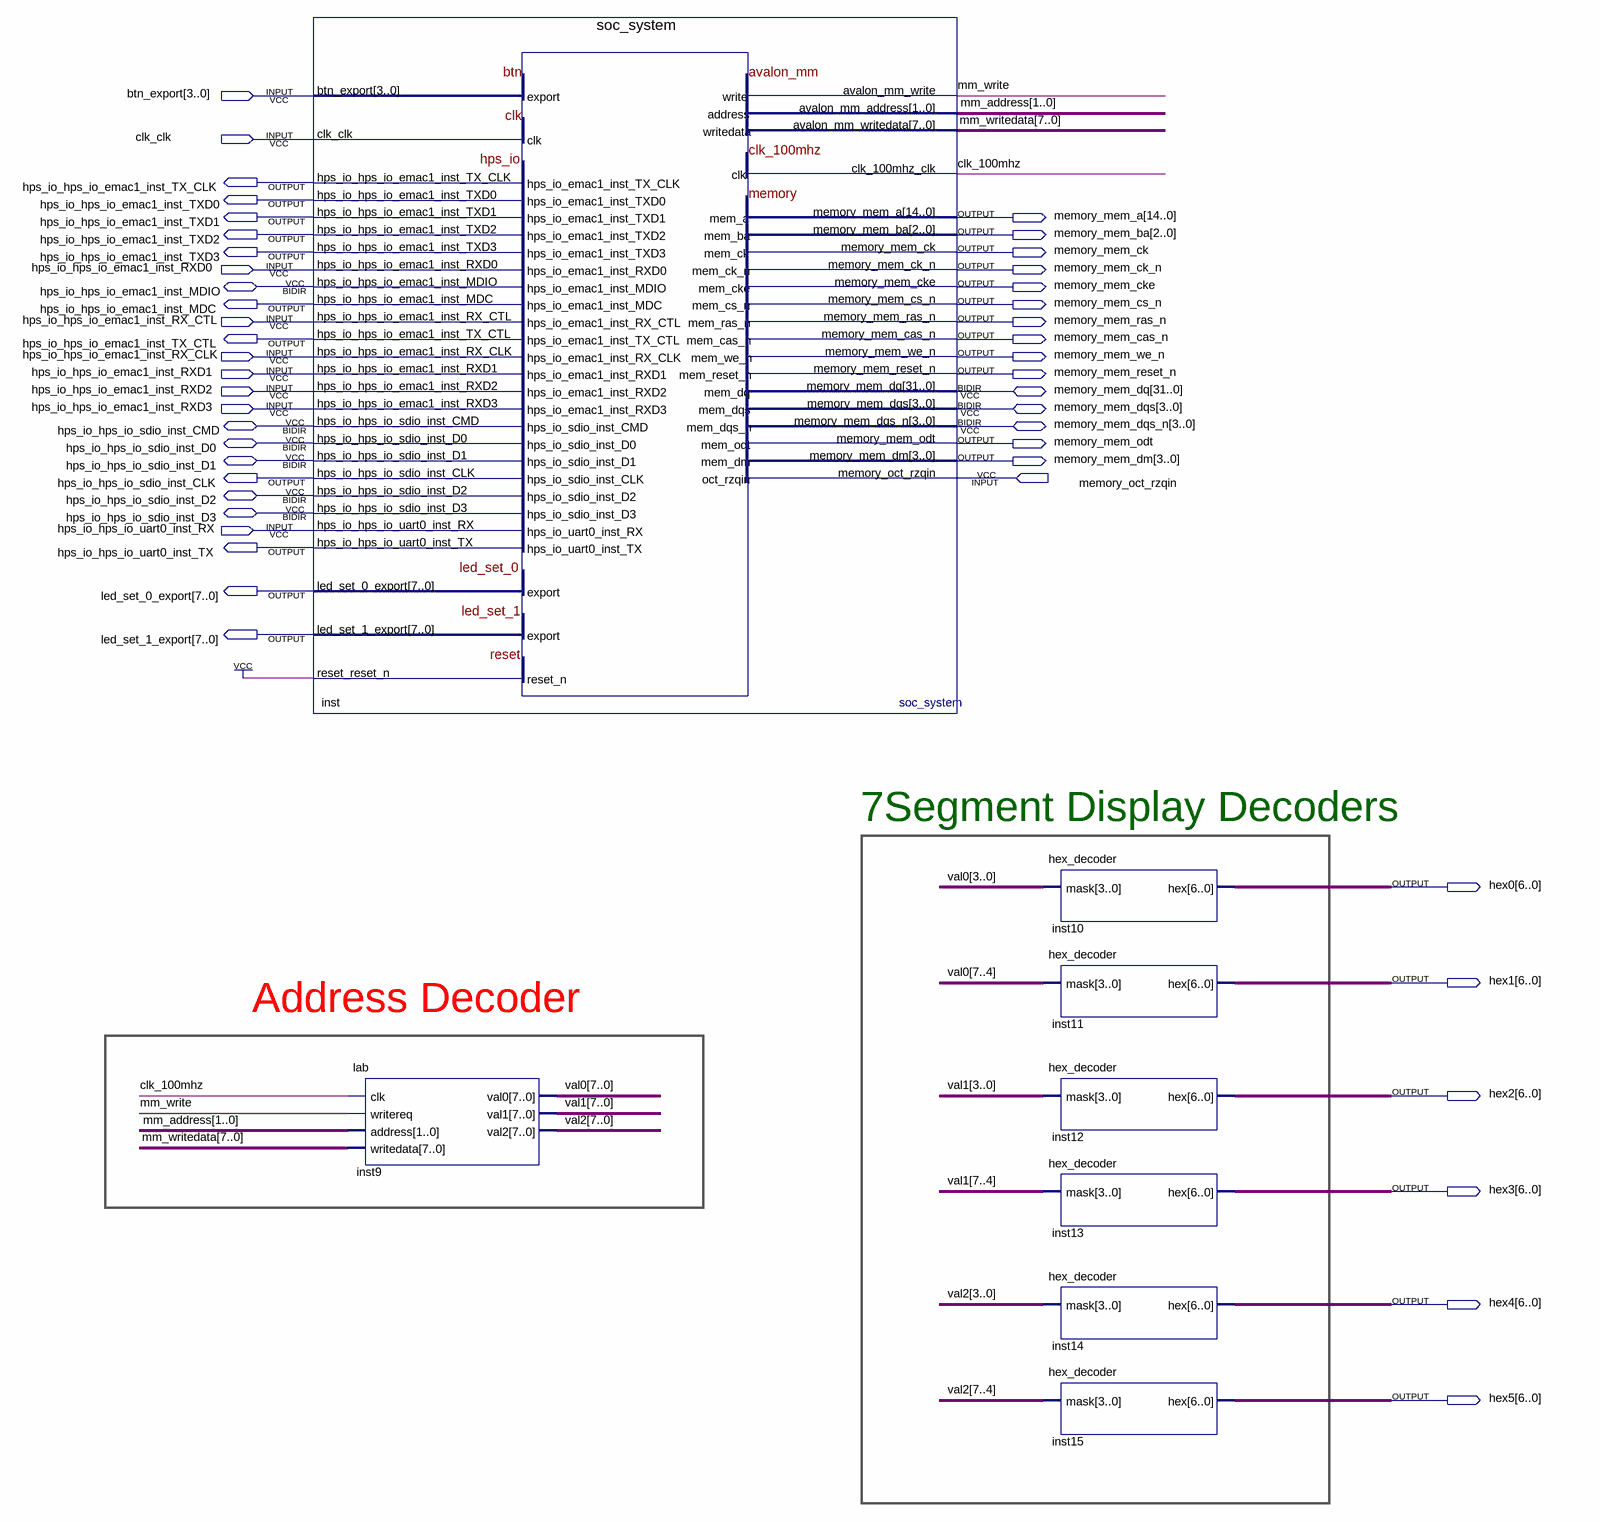
[diagram p0: schematic sheet]
// Quartus schematic main.bdf as structural Verilog: 8 symbols, 48 pins
module main (
  input  [3:0] btn_export,
  input  clk_clk,
  input  hps_io_hps_io_emac1_inst_RXD0,
  input  hps_io_hps_io_emac1_inst_RX_CTL,
  input  hps_io_hps_io_emac1_inst_RX_CLK,
  input  hps_io_hps_io_emac1_inst_RXD1,
  input  hps_io_hps_io_emac1_inst_RXD2,
  input  hps_io_hps_io_emac1_inst_RXD3,
  input  memory_oct_rzqin,
  input  hps_io_hps_io_uart0_inst_RX,
  inout  hps_io_hps_io_emac1_inst_MDIO,
  inout  [31:0] memory_mem_dq,
  inout  [3:0] memory_mem_dqs,
  inout  hps_io_hps_io_sdio_inst_CMD,
  inout  [3:0] memory_mem_dqs_n,
  inout  hps_io_hps_io_sdio_inst_D0,
  inout  hps_io_hps_io_sdio_inst_D1,
  inout  hps_io_hps_io_sdio_inst_D2,
  inout  hps_io_hps_io_sdio_inst_D3,
  output hps_io_hps_io_emac1_inst_TX_CLK,
  output hps_io_hps_io_emac1_inst_TXD0,
  output hps_io_hps_io_emac1_inst_TXD1,
  output [14:0] memory_mem_a,
  output hps_io_hps_io_emac1_inst_TXD2,
  output [2:0] memory_mem_ba,
  output hps_io_hps_io_emac1_inst_TXD3,
  output memory_mem_ck,
  output memory_mem_ck_n,
  output memory_mem_cke,
  output hps_io_hps_io_emac1_inst_MDC,
  output memory_mem_cs_n,
  output memory_mem_ras_n,
  output hps_io_hps_io_emac1_inst_TX_CTL,
  output memory_mem_cas_n,
  output memory_mem_we_n,
  output memory_mem_reset_n,
  output memory_mem_odt,
  output [3:0] memory_mem_dm,
  output hps_io_hps_io_sdio_inst_CLK,
  output hps_io_hps_io_uart0_inst_TX,
  output [7:0] led_set_0_export,
  output [7:0] led_set_1_export,
  output [6:0] hex0,
  output [6:0] hex1,
  output [6:0] hex2,
  output [6:0] hex3,
  output [6:0] hex4,
  output [6:0] hex5
);

  wire clk_100mhz, mm_write;
  wire [1:0] mm_address;
  wire [7:0] mm_writedata, val0, val1, val2;

  soc_system inst (
    .btn_export(btn_export), .clk_clk(clk_clk),
    .hps_io_hps_io_emac1_inst_RXD0(hps_io_hps_io_emac1_inst_RXD0),
    .hps_io_hps_io_emac1_inst_RX_CTL(hps_io_hps_io_emac1_inst_RX_CTL),
    .hps_io_hps_io_emac1_inst_RX_CLK(hps_io_hps_io_emac1_inst_RX_CLK),
    .hps_io_hps_io_emac1_inst_RXD1(hps_io_hps_io_emac1_inst_RXD1),
    .hps_io_hps_io_emac1_inst_RXD2(hps_io_hps_io_emac1_inst_RXD2),
    .hps_io_hps_io_emac1_inst_RXD3(hps_io_hps_io_emac1_inst_RXD3),
    .hps_io_hps_io_uart0_inst_RX(hps_io_hps_io_uart0_inst_RX), .memory_oct_rzqin(memory_oct_rzqin),
    .reset_reset_n(1'b1), .avalon_mm_write(mm_write), .avalon_mm_address(mm_address),
    .avalon_mm_writedata(mm_writedata), .clk_100mhz_clk(clk_100mhz),
    .hps_io_hps_io_emac1_inst_TX_CLK(hps_io_hps_io_emac1_inst_TX_CLK),
    .hps_io_hps_io_emac1_inst_TXD0(hps_io_hps_io_emac1_inst_TXD0),
    .hps_io_hps_io_emac1_inst_TXD1(hps_io_hps_io_emac1_inst_TXD1),
    .hps_io_hps_io_emac1_inst_TXD2(hps_io_hps_io_emac1_inst_TXD2),
    .hps_io_hps_io_emac1_inst_TXD3(hps_io_hps_io_emac1_inst_TXD3),
    .hps_io_hps_io_emac1_inst_MDC(hps_io_hps_io_emac1_inst_MDC),
    .hps_io_hps_io_emac1_inst_TX_CTL(hps_io_hps_io_emac1_inst_TX_CTL),
    .hps_io_hps_io_sdio_inst_CLK(hps_io_hps_io_sdio_inst_CLK),
    .hps_io_hps_io_uart0_inst_TX(hps_io_hps_io_uart0_inst_TX), .led_set_0_export(led_set_0_export),
    .led_set_1_export(led_set_1_export), .memory_mem_a(memory_mem_a), .memory_mem_ba(memory_mem_ba),
    .memory_mem_ck(memory_mem_ck), .memory_mem_ck_n(memory_mem_ck_n), .memory_mem_cke(memory_mem_cke),
    .memory_mem_cs_n(memory_mem_cs_n), .memory_mem_ras_n(memory_mem_ras_n),
    .memory_mem_cas_n(memory_mem_cas_n), .memory_mem_we_n(memory_mem_we_n),
    .memory_mem_reset_n(memory_mem_reset_n), .memory_mem_odt(memory_mem_odt), .memory_mem_dm(memory_mem_dm),
    .hps_io_hps_io_emac1_inst_MDIO(hps_io_hps_io_emac1_inst_MDIO),
    .hps_io_hps_io_sdio_inst_CMD(hps_io_hps_io_sdio_inst_CMD),
    .hps_io_hps_io_sdio_inst_D0(hps_io_hps_io_sdio_inst_D0),
    .hps_io_hps_io_sdio_inst_D1(hps_io_hps_io_sdio_inst_D1),
    .hps_io_hps_io_sdio_inst_D2(hps_io_hps_io_sdio_inst_D2),
    .hps_io_hps_io_sdio_inst_D3(hps_io_hps_io_sdio_inst_D3), .memory_mem_dq(memory_mem_dq),
    .memory_mem_dqs(memory_mem_dqs), .memory_mem_dqs_n(memory_mem_dqs_n));
  lab inst9 (
    .clk(clk_100mhz), .writereq(mm_write), .address(mm_address), .writedata(mm_writedata), .val0(val0),
    .val1(val1), .val2(val2));
  hex_decoder inst10 (.mask(val0[3:0]), .hex(hex0));
  hex_decoder inst11 (.mask(val0[7:4]), .hex(hex1));
  hex_decoder inst12 (.mask(val1[3:0]), .hex(hex2));
  hex_decoder inst13 (.mask(val1[7:4]), .hex(hex3));
  hex_decoder inst14 (.mask(val2[3:0]), .hex(hex4));
  hex_decoder inst15 (.mask(val2[7:4]), .hex(hex5));

  // Notes on the sheet:
  //   7Segment Display Decoders
  //   Address Decoder
endmodule
